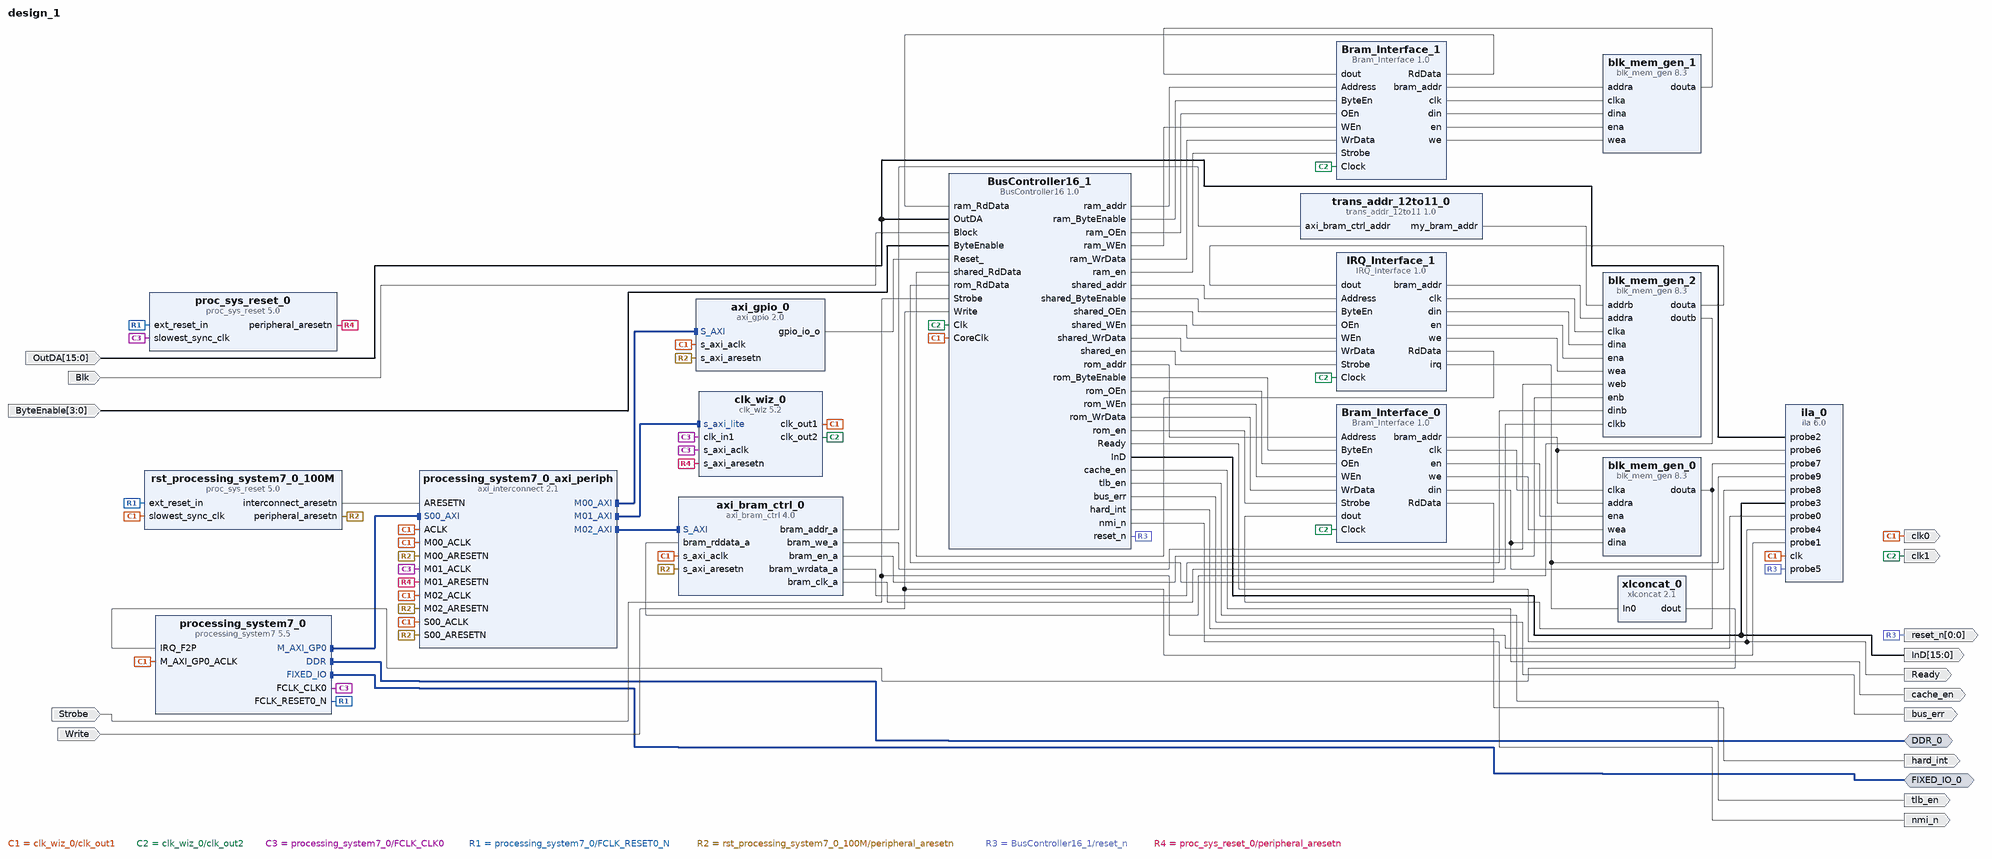
[diagram p0: block diagram of the top level]
# Vivado block design design_1, Vivado 2015.4
create_bd_design design_1

create_bd_intf_port -mode Master -vlnv xilinx.com:interface:ddrx_rtl:1.0 DDR_0
create_bd_intf_port -mode Master -vlnv xilinx.com:display_processing_system7:fixedio_rtl:1.0 FIXED_IO_0
create_bd_port -dir O clk0
create_bd_port -dir O clk1
create_bd_port -dir I -from 15 -to 0 OutDA
create_bd_port -dir I Strobe
create_bd_port -dir I Write
create_bd_port -dir O Ready
create_bd_port -dir O -from 15 -to 0 InD
create_bd_port -dir O -from 0 -to 0 reset_n
create_bd_port -dir I Blk
create_bd_port -dir I -from 3 -to 0 ByteEnable
create_bd_port -dir O cache_en
create_bd_port -dir O tlb_en
create_bd_port -dir O bus_err
create_bd_port -dir O hard_int
create_bd_port -dir O nmi_n

create_bd_cell -type ip -vlnv xilinx.com:ip:clk_wiz:5.2 clk_wiz_0
set_property -dict [list \
  CONFIG.USE_DYN_RECONFIG true \
  CONFIG.CLKOUT2_USED true \
  CONFIG.CLKOUT3_USED false \
  CONFIG.NUM_OUT_CLKS 2 \
  CONFIG.CLKOUT1_REQUESTED_OUT_FREQ 30.000 \
  CONFIG.CLKOUT2_REQUESTED_OUT_FREQ 15.000 \
  CONFIG.CLKOUT3_REQUESTED_OUT_FREQ 15.000 \
  CONFIG.RESET_PORT reset \
  CONFIG.MMCM_DIVCLK_DIVIDE 5 \
  CONFIG.MMCM_CLKFBOUT_MULT_F 50.250 \
  CONFIG.MMCM_CLKOUT0_DIVIDE_F 33.500 \
  CONFIG.MMCM_CLKOUT1_DIVIDE 67 \
  CONFIG.MMCM_CLKOUT2_DIVIDE 1 \
  CONFIG.RESET_TYPE ACTIVE_HIGH \
  CONFIG.CLKOUT1_JITTER 292.088 \
  CONFIG.CLKOUT1_PHASE_ERROR 298.923 \
  CONFIG.CLKOUT2_JITTER 332.016 \
  CONFIG.CLKOUT2_PHASE_ERROR 298.923 \
  CONFIG.CLKOUT3_JITTER 187.401 \
  CONFIG.CLKOUT3_PHASE_ERROR 94.994 \
] [get_bd_cells clk_wiz_0]
create_bd_cell -type ip -vlnv xilinx.com:ip:processing_system7:5.5 processing_system7_0
set_property -dict [list \
  CONFIG.PCW_FCLK_CLK0_BUF true \
  CONFIG.PCW_APU_PERIPHERAL_FREQMHZ 667 \
  CONFIG.PCW_SDIO_PERIPHERAL_FREQMHZ 50 \
  CONFIG.PCW_UART_PERIPHERAL_FREQMHZ 50 \
  CONFIG.PCW_FPGA0_PERIPHERAL_FREQMHZ 100 \
  CONFIG.PCW_FPGA1_PERIPHERAL_FREQMHZ 100 \
  CONFIG.PCW_FPGA2_PERIPHERAL_FREQMHZ 33.333333 \
  CONFIG.PCW_USE_FABRIC_INTERRUPT 1 \
  CONFIG.PCW_IRQ_F2P_INTR 1 \
  CONFIG.PCW_PRESET_BANK1_VOLTAGE {LVCMOS 1.8V} \
  CONFIG.PCW_UIPARAM_DDR_PARTNO {MT41K256M16 RE-125} \
  CONFIG.PCW_QSPI_PERIPHERAL_ENABLE 1 \
  CONFIG.PCW_QSPI_GRP_SINGLE_SS_ENABLE 1 \
  CONFIG.PCW_QSPI_GRP_SINGLE_SS_IO {MIO 1 .. 6} \
  CONFIG.PCW_QSPI_GRP_FBCLK_ENABLE 1 \
  CONFIG.PCW_QSPI_GRP_FBCLK_IO {MIO 8} \
  CONFIG.PCW_ENET0_PERIPHERAL_ENABLE 1 \
  CONFIG.PCW_ENET0_ENET0_IO {MIO 16 .. 27} \
  CONFIG.PCW_ENET0_GRP_MDIO_ENABLE 1 \
  CONFIG.PCW_ENET0_GRP_MDIO_IO {MIO 52 .. 53} \
  CONFIG.PCW_ENET0_RESET_ENABLE 0 \
  CONFIG.PCW_SD0_PERIPHERAL_ENABLE 1 \
  CONFIG.PCW_SD0_SD0_IO {MIO 40 .. 45} \
  CONFIG.PCW_SD0_GRP_CD_ENABLE 1 \
  CONFIG.PCW_SD0_GRP_CD_IO {MIO 46} \
  CONFIG.PCW_SD0_GRP_WP_ENABLE 1 \
  CONFIG.PCW_SD0_GRP_WP_IO {MIO 50} \
  CONFIG.PCW_UART1_PERIPHERAL_ENABLE 1 \
  CONFIG.PCW_UART1_UART1_IO {MIO 48 .. 49} \
  CONFIG.PCW_TTC0_PERIPHERAL_ENABLE 1 \
  CONFIG.PCW_TTC0_TTC0_IO EMIO \
  CONFIG.PCW_USB0_PERIPHERAL_ENABLE 1 \
  CONFIG.PCW_USB0_USB0_IO {MIO 28 .. 39} \
  CONFIG.PCW_USB0_RESET_ENABLE 1 \
  CONFIG.PCW_USB0_RESET_IO {MIO 7} \
  CONFIG.PCW_I2C0_PERIPHERAL_ENABLE 1 \
  CONFIG.PCW_I2C_RESET_ENABLE 0 \
  CONFIG.PCW_GPIO_PERIPHERAL_ENABLE 1 \
  CONFIG.PCW_GPIO_MIO_GPIO_ENABLE 1 \
] [get_bd_cells processing_system7_0]
# 161 more settings of processing_system7_0 are not shown: defaults, MIO pin electricals, DDR timing, and values the tool derives
create_bd_cell -type ip -vlnv xilinx.com:ip:axi_gpio:2.0 axi_gpio_0
set_property -dict {CONFIG.C_GPIO_WIDTH 1 CONFIG.C_DOUT_DEFAULT 0x00000001 CONFIG.C_ALL_OUTPUTS 1} [get_bd_cells axi_gpio_0]
create_bd_cell -type ip -vlnv xilinx.com:ip:axi_interconnect:2.1 processing_system7_0_axi_periph
set_property -dict {CONFIG.NUM_SI 1 CONFIG.NUM_MI 3} [get_bd_cells processing_system7_0_axi_periph]
create_bd_cell -type ip -vlnv xilinx.com:ip:proc_sys_reset:5.0 rst_processing_system7_0_100M
create_bd_cell -type ip -vlnv xilinx.com:ip:proc_sys_reset:5.0 proc_sys_reset_0
create_bd_cell -type ip -vlnv xilinx.com:ip:ila:6.0 ila_0
set_property -dict [list \
  CONFIG.C_PROBE8_WIDTH 16 \
  CONFIG.C_PROBE7_WIDTH 16 \
  CONFIG.C_PROBE6_WIDTH 13 \
  CONFIG.C_PROBE3_WIDTH 16 \
  CONFIG.C_PROBE2_WIDTH 16 \
  CONFIG.C_DATA_DEPTH 16384 \
  CONFIG.C_NUM_OF_PROBES 10 \
  CONFIG.C_ENABLE_ILA_AXI_MON false \
  CONFIG.C_MONITOR_TYPE Native \
] [get_bd_cells ila_0]
create_bd_cell -type ip -vlnv xilinx.com:ip:blk_mem_gen:8.3 blk_mem_gen_0
set_property -dict [list \
  CONFIG.Memory_Type Single_Port_RAM \
  CONFIG.Enable_32bit_Address false \
  CONFIG.Use_Byte_Write_Enable false \
  CONFIG.Write_Width_A 16 \
  CONFIG.Read_Width_A 16 \
  CONFIG.Operating_Mode_A NO_CHANGE \
  CONFIG.Enable_A Use_ENA_Pin \
  CONFIG.Register_PortA_Output_of_Memory_Primitives false \
  CONFIG.Register_PortA_Output_of_Memory_Core false \
  CONFIG.Load_Init_File true \
  CONFIG.Coe_File ../../../../../../../source_code/Geyser_mem_01/COE/btst.coe \
  CONFIG.Use_RSTA_Pin false \
  CONFIG.Port_A_Write_Rate 50 \
  CONFIG.Port_B_Clock 0 \
  CONFIG.Port_B_Enable_Rate 0 \
  CONFIG.use_bram_block Stand_Alone \
] [get_bd_cells blk_mem_gen_0]
create_bd_cell -type ip -vlnv xilinx.com:ip:blk_mem_gen:8.3 blk_mem_gen_1
set_property -dict [list \
  CONFIG.Memory_Type Single_Port_RAM \
  CONFIG.Enable_32bit_Address false \
  CONFIG.Use_Byte_Write_Enable false \
  CONFIG.Write_Width_A 16 \
  CONFIG.Read_Width_A 16 \
  CONFIG.Operating_Mode_A NO_CHANGE \
  CONFIG.Register_PortA_Output_of_Memory_Primitives false \
  CONFIG.Load_Init_File true \
  CONFIG.Coe_File ../../../../../../../source_code/Geyser_mem_01/COE/bram.coe \
  CONFIG.Use_RSTA_Pin false \
  CONFIG.Port_B_Clock 0 \
  CONFIG.Port_B_Enable_Rate 0 \
  CONFIG.use_bram_block Stand_Alone \
] [get_bd_cells blk_mem_gen_1]
create_bd_cell -type ip -vlnv xilinx.com:user:Bram_Interface:1.0 Bram_Interface_0
create_bd_cell -type ip -vlnv xilinx.com:user:Bram_Interface:1.0 Bram_Interface_1
create_bd_cell -type ip -vlnv xilinx.com:user:BusController16:1.0 BusController16_1
create_bd_cell -type ip -vlnv xilinx.com:ip:blk_mem_gen:8.3 blk_mem_gen_2
set_property -dict [list \
  CONFIG.Memory_Type True_Dual_Port_RAM \
  CONFIG.Enable_32bit_Address false \
  CONFIG.Use_Byte_Write_Enable false \
  CONFIG.Write_Width_A 16 \
  CONFIG.Write_Depth_A 8192 \
  CONFIG.Read_Width_A 16 \
  CONFIG.Write_Width_B 32 \
  CONFIG.Read_Width_B 32 \
  CONFIG.Enable_B Use_ENB_Pin \
  CONFIG.Register_PortA_Output_of_Memory_Primitives false \
  CONFIG.Register_PortB_Output_of_Memory_Primitives false \
  CONFIG.Load_Init_File true \
  CONFIG.Coe_File ../../../../../../../source_code/Geyser_mem_01/COE/btst2.coe \
  CONFIG.Use_RSTA_Pin false \
  CONFIG.Use_RSTB_Pin false \
  CONFIG.Port_B_Clock 100 \
  CONFIG.Port_B_Write_Rate 50 \
  CONFIG.Port_B_Enable_Rate 100 \
  CONFIG.use_bram_block Stand_Alone \
] [get_bd_cells blk_mem_gen_2]
create_bd_cell -type ip -vlnv xilinx.com:ip:axi_bram_ctrl:4.0 axi_bram_ctrl_0
set_property -dict {CONFIG.SINGLE_PORT_BRAM 1} [get_bd_cells axi_bram_ctrl_0]
create_bd_cell -type ip -vlnv xilinx.com:user:trans_addr_12to11:1.0 trans_addr_12to11_0
create_bd_cell -type ip -vlnv xilinx.com:ip:xlconcat:2.1 xlconcat_0
set_property -dict {CONFIG.NUM_PORTS 1} [get_bd_cells xlconcat_0]
create_bd_cell -type ip -vlnv xilinx.com:user:IRQ_Interface:1.0 IRQ_Interface_1

# ---- connections ----

connect_bd_intf_net [get_bd_intf_pins processing_system7_0/M_AXI_GP0] [get_bd_intf_pins processing_system7_0_axi_periph/S00_AXI]
connect_bd_intf_net [get_bd_intf_pins processing_system7_0_axi_periph/M00_AXI] [get_bd_intf_pins axi_gpio_0/S_AXI]
connect_bd_intf_net [get_bd_intf_pins processing_system7_0_axi_periph/M01_AXI] [get_bd_intf_pins clk_wiz_0/s_axi_lite]
connect_bd_intf_net [get_bd_intf_pins processing_system7_0_axi_periph/M02_AXI] [get_bd_intf_pins axi_bram_ctrl_0/S_AXI]
connect_bd_intf_net [get_bd_intf_ports DDR_0] [get_bd_intf_pins processing_system7_0/DDR]
connect_bd_intf_net [get_bd_intf_ports FIXED_IO_0] [get_bd_intf_pins processing_system7_0/FIXED_IO]
connect_bd_net [get_bd_pins clk_wiz_0/clk_out1] \
  [get_bd_ports clk0] [get_bd_pins axi_gpio_0/s_axi_aclk] [get_bd_pins processing_system7_0/M_AXI_GP0_ACLK] \
  [get_bd_pins rst_processing_system7_0_100M/slowest_sync_clk] [get_bd_pins ila_0/clk] \
  [get_bd_pins BusController16_1/CoreClk] [get_bd_pins axi_bram_ctrl_0/s_axi_aclk] \
  [get_bd_pins processing_system7_0_axi_periph/M00_ACLK] [get_bd_pins processing_system7_0_axi_periph/S00_ACLK] \
  [get_bd_pins processing_system7_0_axi_periph/ACLK] [get_bd_pins processing_system7_0_axi_periph/M02_ACLK]
connect_bd_net [get_bd_pins clk_wiz_0/clk_out2] \
  [get_bd_ports clk1] [get_bd_pins Bram_Interface_0/Clock] [get_bd_pins Bram_Interface_1/Clock] \
  [get_bd_pins BusController16_1/Clk] [get_bd_pins IRQ_Interface_1/Clock]
connect_bd_net [get_bd_ports OutDA] [get_bd_pins ila_0/probe2] [get_bd_pins BusController16_1/OutDA]
connect_bd_net [get_bd_pins processing_system7_0/FCLK_CLK0] \
  [get_bd_pins clk_wiz_0/clk_in1] [get_bd_pins clk_wiz_0/s_axi_aclk] [get_bd_pins proc_sys_reset_0/slowest_sync_clk] \
  [get_bd_pins processing_system7_0_axi_periph/M01_ACLK]
connect_bd_net [get_bd_pins processing_system7_0/FCLK_RESET0_N] \
  [get_bd_pins rst_processing_system7_0_100M/ext_reset_in] [get_bd_pins proc_sys_reset_0/ext_reset_in]
connect_bd_net [get_bd_pins rst_processing_system7_0_100M/peripheral_aresetn] \
  [get_bd_pins axi_gpio_0/s_axi_aresetn] [get_bd_pins axi_bram_ctrl_0/s_axi_aresetn] \
  [get_bd_pins processing_system7_0_axi_periph/S00_ARESETN] [get_bd_pins processing_system7_0_axi_periph/M00_ARESETN] \
  [get_bd_pins processing_system7_0_axi_periph/M02_ARESETN]
connect_bd_net [get_bd_pins rst_processing_system7_0_100M/interconnect_aresetn] [get_bd_pins processing_system7_0_axi_periph/ARESETN]
connect_bd_net [get_bd_ports Strobe] [get_bd_pins ila_0/probe0] [get_bd_pins BusController16_1/Strobe]
connect_bd_net [get_bd_ports Write] [get_bd_pins ila_0/probe1] [get_bd_pins BusController16_1/Write]
connect_bd_net [get_bd_pins BusController16_1/Ready] [get_bd_ports Ready] [get_bd_pins ila_0/probe4]
connect_bd_net [get_bd_pins BusController16_1/InD] [get_bd_ports InD] [get_bd_pins ila_0/probe3]
connect_bd_net [get_bd_pins BusController16_1/reset_n] [get_bd_ports reset_n] [get_bd_pins ila_0/probe5]
connect_bd_net [get_bd_pins proc_sys_reset_0/peripheral_aresetn] \
  [get_bd_pins clk_wiz_0/s_axi_aresetn] [get_bd_pins processing_system7_0_axi_periph/M01_ARESETN]
connect_bd_net [get_bd_ports Blk] [get_bd_pins BusController16_1/Block]
connect_bd_net [get_bd_pins axi_gpio_0/gpio_io_o] [get_bd_pins BusController16_1/Reset_]
connect_bd_net [get_bd_ports ByteEnable] [get_bd_pins BusController16_1/ByteEnable]
connect_bd_net [get_bd_pins Bram_Interface_0/bram_addr] [get_bd_pins blk_mem_gen_0/addra] [get_bd_pins ila_0/probe6]
connect_bd_net [get_bd_pins Bram_Interface_0/clk] [get_bd_pins blk_mem_gen_0/clka]
connect_bd_net [get_bd_pins Bram_Interface_0/din] [get_bd_pins blk_mem_gen_0/dina] [get_bd_pins ila_0/probe8]
connect_bd_net [get_bd_pins Bram_Interface_0/en] [get_bd_pins blk_mem_gen_0/ena]
connect_bd_net [get_bd_pins blk_mem_gen_0/douta] [get_bd_pins Bram_Interface_0/dout] [get_bd_pins ila_0/probe7]
connect_bd_net [get_bd_pins Bram_Interface_0/we] [get_bd_pins blk_mem_gen_0/wea]
connect_bd_net [get_bd_pins Bram_Interface_1/bram_addr] [get_bd_pins blk_mem_gen_1/addra]
connect_bd_net [get_bd_pins Bram_Interface_1/clk] [get_bd_pins blk_mem_gen_1/clka]
connect_bd_net [get_bd_pins Bram_Interface_1/din] [get_bd_pins blk_mem_gen_1/dina]
connect_bd_net [get_bd_pins Bram_Interface_1/en] [get_bd_pins blk_mem_gen_1/ena]
connect_bd_net [get_bd_pins blk_mem_gen_1/douta] [get_bd_pins Bram_Interface_1/dout]
connect_bd_net [get_bd_pins Bram_Interface_1/we] [get_bd_pins blk_mem_gen_1/wea]
connect_bd_net [get_bd_pins BusController16_1/cache_en] [get_bd_ports cache_en]
connect_bd_net [get_bd_pins BusController16_1/tlb_en] [get_bd_ports tlb_en]
connect_bd_net [get_bd_pins BusController16_1/bus_err] [get_bd_ports bus_err]
connect_bd_net [get_bd_pins BusController16_1/hard_int] [get_bd_ports hard_int]
connect_bd_net [get_bd_pins BusController16_1/nmi_n] [get_bd_ports nmi_n]
connect_bd_net [get_bd_pins Bram_Interface_1/RdData] [get_bd_pins BusController16_1/ram_RdData]
connect_bd_net [get_bd_pins Bram_Interface_0/RdData] [get_bd_pins BusController16_1/rom_RdData]
connect_bd_net [get_bd_pins BusController16_1/rom_addr] [get_bd_pins Bram_Interface_0/Address]
connect_bd_net [get_bd_pins BusController16_1/rom_ByteEnable] [get_bd_pins Bram_Interface_0/ByteEn]
connect_bd_net [get_bd_pins BusController16_1/rom_OEn] [get_bd_pins Bram_Interface_0/OEn]
connect_bd_net [get_bd_pins BusController16_1/rom_WEn] [get_bd_pins Bram_Interface_0/WEn]
connect_bd_net [get_bd_pins BusController16_1/rom_WrData] [get_bd_pins Bram_Interface_0/WrData]
connect_bd_net [get_bd_pins BusController16_1/rom_en] [get_bd_pins Bram_Interface_0/Strobe]
connect_bd_net [get_bd_pins BusController16_1/ram_addr] [get_bd_pins Bram_Interface_1/Address]
connect_bd_net [get_bd_pins BusController16_1/ram_ByteEnable] [get_bd_pins Bram_Interface_1/ByteEn]
connect_bd_net [get_bd_pins BusController16_1/ram_OEn] [get_bd_pins Bram_Interface_1/OEn]
connect_bd_net [get_bd_pins BusController16_1/ram_WEn] [get_bd_pins Bram_Interface_1/WEn]
connect_bd_net [get_bd_pins BusController16_1/ram_WrData] [get_bd_pins Bram_Interface_1/WrData]
connect_bd_net [get_bd_pins BusController16_1/ram_en] [get_bd_pins Bram_Interface_1/Strobe]
connect_bd_net [get_bd_pins BusController16_1/shared_addr] [get_bd_pins IRQ_Interface_1/Address]
connect_bd_net [get_bd_pins BusController16_1/shared_ByteEnable] [get_bd_pins IRQ_Interface_1/ByteEn]
connect_bd_net [get_bd_pins BusController16_1/shared_OEn] [get_bd_pins IRQ_Interface_1/OEn]
connect_bd_net [get_bd_pins BusController16_1/shared_WEn] [get_bd_pins IRQ_Interface_1/WEn]
connect_bd_net [get_bd_pins BusController16_1/shared_WrData] [get_bd_pins IRQ_Interface_1/WrData]
connect_bd_net [get_bd_pins BusController16_1/shared_en] [get_bd_pins IRQ_Interface_1/Strobe]
connect_bd_net [get_bd_pins axi_bram_ctrl_0/bram_we_a] [get_bd_pins blk_mem_gen_2/web]
connect_bd_net [get_bd_pins axi_bram_ctrl_0/bram_en_a] [get_bd_pins blk_mem_gen_2/enb]
connect_bd_net [get_bd_pins axi_bram_ctrl_0/bram_wrdata_a] [get_bd_pins blk_mem_gen_2/dinb]
connect_bd_net [get_bd_pins blk_mem_gen_2/doutb] [get_bd_pins axi_bram_ctrl_0/bram_rddata_a]
connect_bd_net [get_bd_pins axi_bram_ctrl_0/bram_clk_a] [get_bd_pins blk_mem_gen_2/clkb]
connect_bd_net [get_bd_pins axi_bram_ctrl_0/bram_addr_a] [get_bd_pins trans_addr_12to11_0/axi_bram_ctrl_addr]
connect_bd_net [get_bd_pins trans_addr_12to11_0/my_bram_addr] [get_bd_pins blk_mem_gen_2/addrb]
connect_bd_net [get_bd_pins IRQ_Interface_1/irq] [get_bd_pins ila_0/probe9] [get_bd_pins xlconcat_0/In0]
connect_bd_net [get_bd_pins xlconcat_0/dout] [get_bd_pins processing_system7_0/IRQ_F2P]
connect_bd_net [get_bd_pins IRQ_Interface_1/RdData] [get_bd_pins BusController16_1/shared_RdData]
connect_bd_net [get_bd_pins IRQ_Interface_1/bram_addr] [get_bd_pins blk_mem_gen_2/addra]
connect_bd_net [get_bd_pins IRQ_Interface_1/clk] [get_bd_pins blk_mem_gen_2/clka]
connect_bd_net [get_bd_pins IRQ_Interface_1/din] [get_bd_pins blk_mem_gen_2/dina]
connect_bd_net [get_bd_pins IRQ_Interface_1/en] [get_bd_pins blk_mem_gen_2/ena]
connect_bd_net [get_bd_pins IRQ_Interface_1/we] [get_bd_pins blk_mem_gen_2/wea]
connect_bd_net [get_bd_pins blk_mem_gen_2/douta] [get_bd_pins IRQ_Interface_1/dout]

# ---- address map ----
assign_bd_address -offset 0x40000000 -range 8K -target_address_space [get_bd_addr_spaces processing_system7_0/Data] [get_bd_addr_segs axi_bram_ctrl_0/S_AXI/Mem0]
assign_bd_address -offset 0x41200000 -range 64K -target_address_space [get_bd_addr_spaces processing_system7_0/Data] [get_bd_addr_segs axi_gpio_0/S_AXI/Reg]
assign_bd_address -offset 0x43C00000 -range 64K -target_address_space [get_bd_addr_spaces processing_system7_0/Data] [get_bd_addr_segs clk_wiz_0/s_axi_lite/Reg]

validate_bd_design
save_bd_design
